# EAGLE design 00_dynaRoACH_MotorDriver_1_Chan (EAGLE 6.5.0)
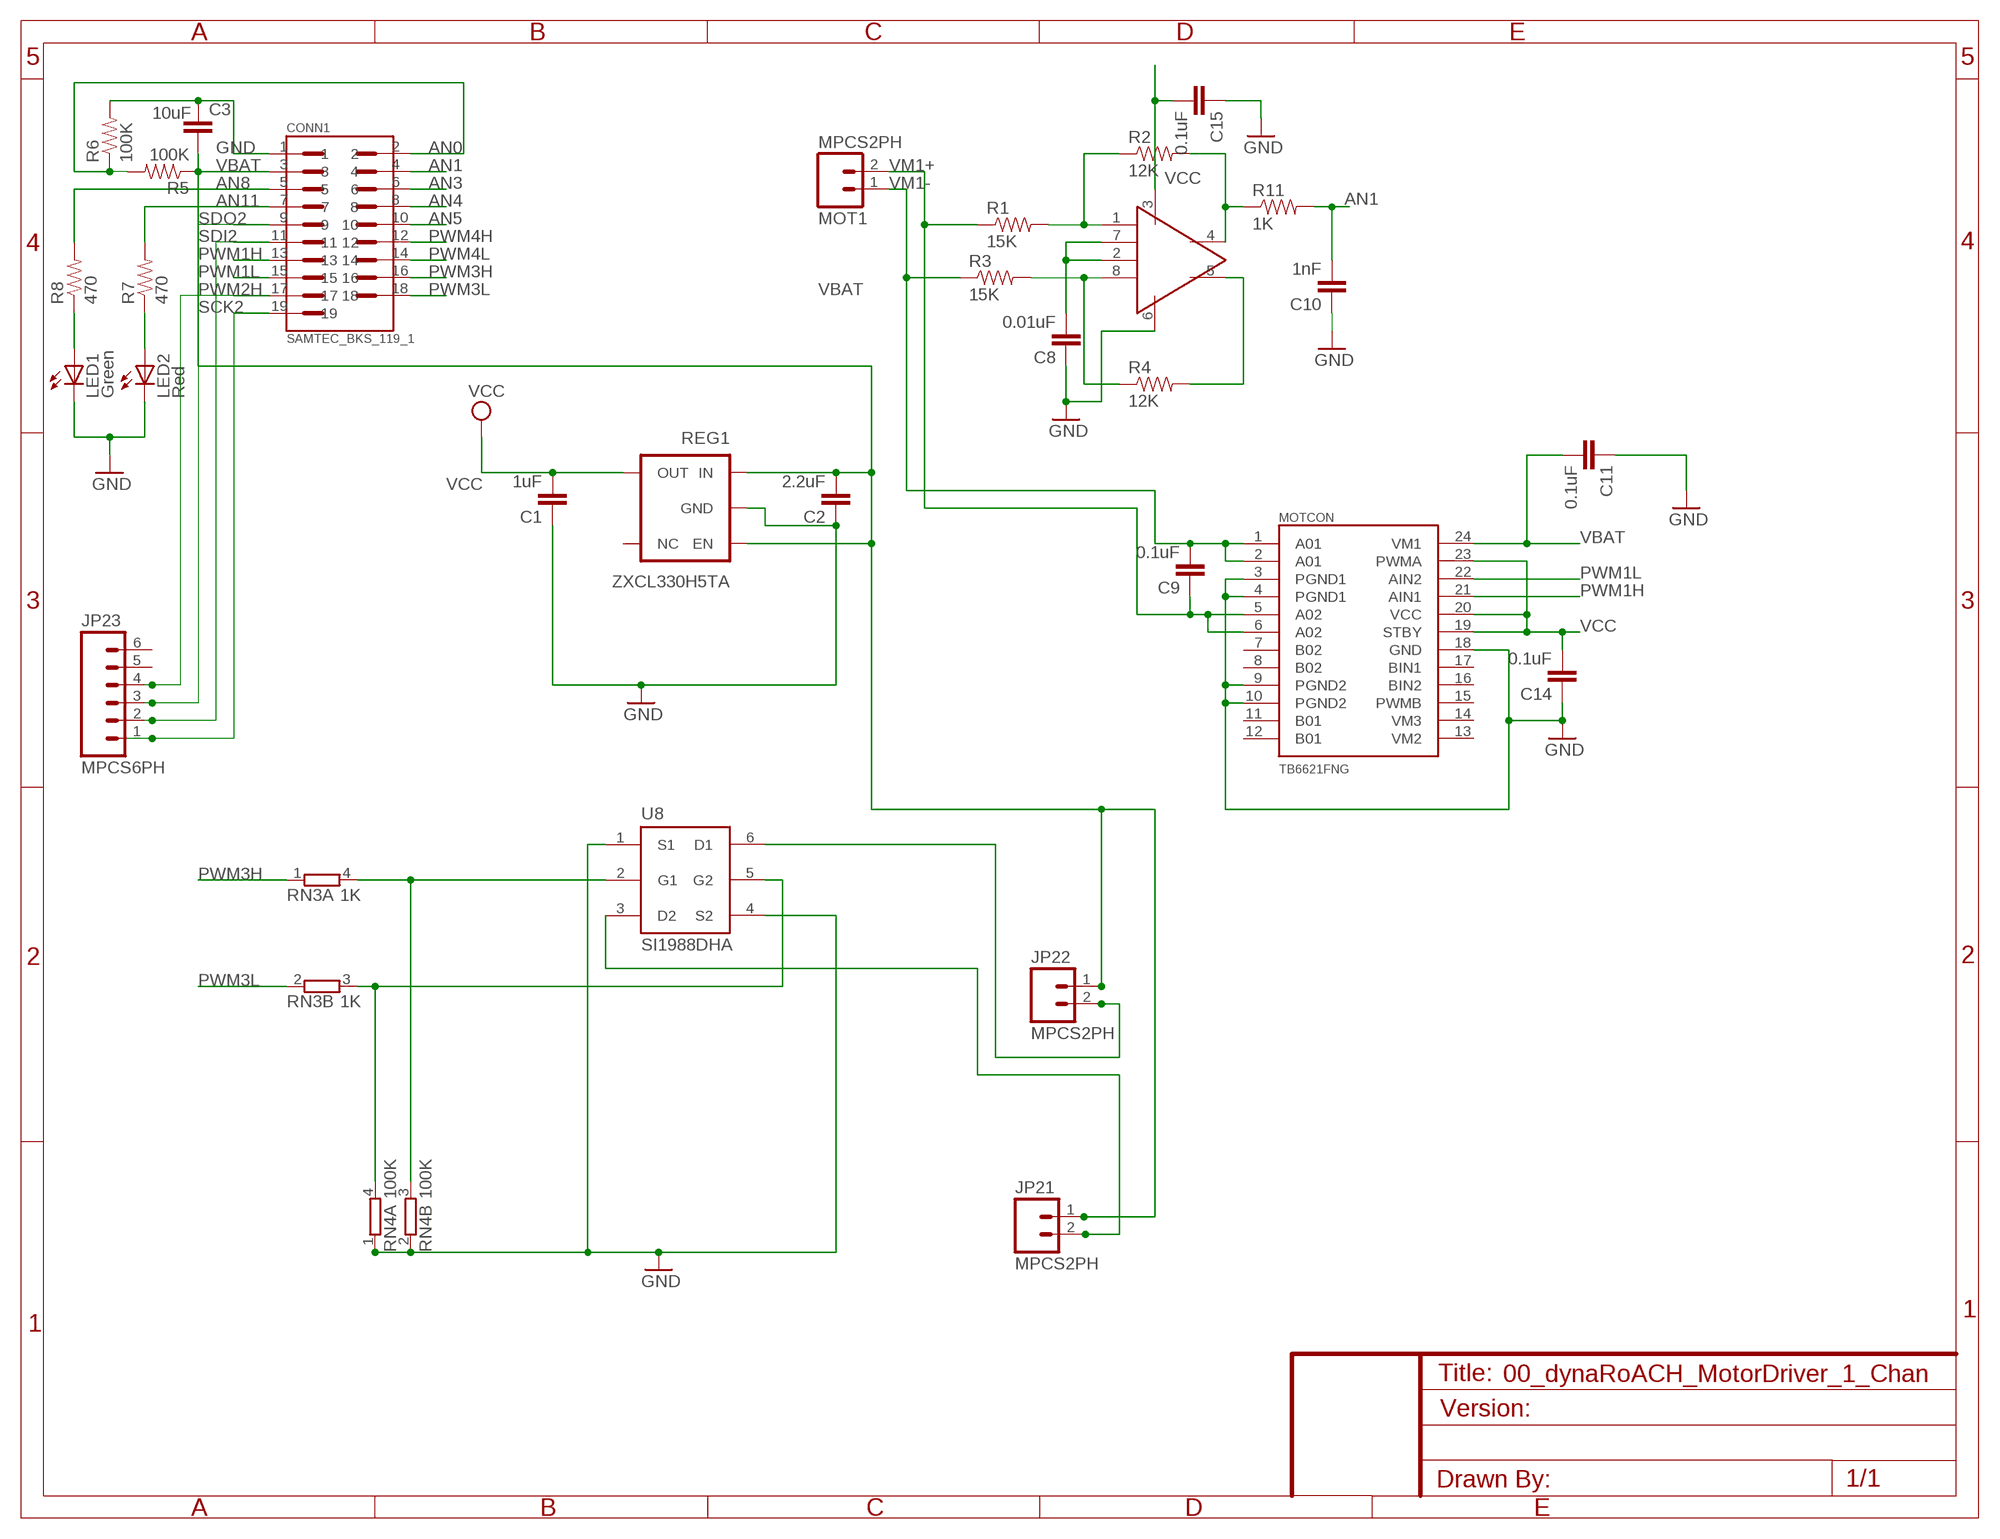
[diagram p0: schematic, sheet 1]

## Parts
C1  1uF  CAP0402-CAP  [0402-CAP]
C2  2.2uF  CAP0402-CAP  [0402-CAP]
C3  10uF  CAP0603-CAP  [0603-CAP]
C8  0.01uF  CAP0402-CAP  [0402-CAP]
C9  0.1uF  CAP0402-CAP  [0402-CAP]
C10  1nF  CAP0402-CAP  [0402-CAP]
C11  0.1uF  CAP0402-CAP  [0402-CAP]
C14  0.1uF  CAP0402-CAP  [0402-CAP]
C15  0.1uF  CAP0402-CAP  [0402-CAP]
CONN1  SAMTEC_BKS_119_1  [SAMTEC_19P_1MM_SOCKET]
JP21  MPCS2PH  [MOLEX-PICO_CLASP_S2P]
JP22  MPCS2PH  [MOLEX-PICO_CLASP_S2P]
JP23  MPCS6PH  [MOLEX-PICO_CLASP_S6P]
LED1  Green  LED0603  [LED-0603]
LED2  Red  LED0603  [LED-0603]
MOT1  MPCS2PH  [MOLEX-PICO_CLASP_S2P]
MOTCON  TB6621FNG  [SSOP24]
R1  15K  RESISTOR0402-RES  [0402-RES]
R2  12K  RESISTOR0402-RES  [0402-RES]
R3  15K  RESISTOR0402-RES  [0402-RES]
R4  12K  RESISTOR0402-RES  [0402-RES]
R5  100K  RESISTOR0402-RES  [0402-RES]
R6  100K  RESISTOR0402-RES  [0402-RES]
R7  470  RESISTOR0402-RES  [0402-RES]
R8  470  RESISTOR0402-RES  [0402-RES]
R11  1K  RESISTOR0402-RES  [0402-RES]
REG1  ZXCL330H5TA  [SC-70-5]
RN3  1K  2R-NEXB24V  [EXB24V]
RN4  100K  2R-NEXB24V  [EXB24V]
U8  SI1988DHA  [SC-70-6]
U$1  LTC1992  [8-PIN_MSOP]

## Nets
AN0 [Signal]: CONN1.2 R5.2 R6.1
AN1 [Signal]: C10.2 CONN1.4 R11.2
AN3 [Signal]: CONN1.6
AN4 [Signal]: CONN1.8
AN5 [Signal]: CONN1.10
AN8 [Signal]: CONN1.5 R8.2
AN11 [Signal]: CONN1.7 R7.2
GND [GND]: C1.1 C2.1 C3.1 C8.1 C10.1 C11.1 C14.1 C15.1 CONN1.1 LED1.C LED2.C MOTCON.3(PGND1) MOTCON.4(PGND1) MOTCON.9(PGND2) MOTCON.10(PGND2) MOTCON.18(GND) R6.2 REG1.2(GND) RN4.1 RN4.2 U8.1(S1) U8.4(S2) U$1.6(GND)
N$1: R1.2 R2.1 U$1.1(-)
N$2: R3.2 R4.1 U$1.8(+)
N$4 [Signal]: RN3.4 RN4.3 U8.2(G1)
N$5: LED1.A R8.1
N$6: LED2.A R7.1
N$7: R4.2 U$1.5(OUT-)
N$12: C8.2 U$1.2(V_OCM) U$1.7(V_MID)
N$18: R2.2 R11.1 U$1.4(OUT+)
N$21 [Signal]: JP22.2 U8.6(D1)
N$22 [Signal]: JP21.2 U8.3(D2)
N$50 [Signal]: RN3.3 RN4.4 U8.5(G2)
PWM1H [Signal]: CONN1.13 MOTCON.21(AIN1)
PWM1L [Signal]: CONN1.15 MOTCON.22(AIN2)
PWM2H [Signal]: CONN1.17 JP23.4
PWM3H [Signal]: CONN1.16 RN3.1
PWM3L [Signal]: CONN1.18 RN3.2
PWM4H [Signal]: CONN1.12
PWM4L [Signal]: CONN1.14
SCK2 [Signal]: CONN1.19 JP23.1
SDI2 [Signal]: CONN1.11 JP23.2
SDO2 [Signal]: CONN1.9 JP23.3
VBAT: C2.2 C3.2 C11.2 CONN1.3 JP21.1 JP22.1 MOTCON.24(VM1) R5.1 REG1.1(IN) REG1.3(EN)
VCC [VCC]: C1.2 C14.2 C15.2 MOTCON.19(STBY) MOTCON.20(VCC) MOTCON.23(PWMA) REG1.5(OUT) U$1.3(VDD)
VM1+: C9.1 MOT1.2 MOTCON.5(A02) MOTCON.6(A02) R1.1
VM1-: C9.2 MOT1.1 MOTCON.1(A01) MOTCON.2(A01) R3.1
Unconnected: JP23.5 JP23.6 MOTCON.7(B02) MOTCON.8(B02) MOTCON.11(B01) MOTCON.12(B01) MOTCON.13(VM2) MOTCON.14(VM3) MOTCON.15(PWMB) MOTCON.16(BIN2) MOTCON.17(BIN1) REG1.4(NC)

## Library data of the parts
C1-C3 C8-C11 C14 C15 = SparkFun:CAP: Capacitor Standard 0603 ceramic capacitor, and 0.1" leaded capacitor.
CONN1 = AMH:SAMTEC_BKS_119_1: Socket connector
JP21 JP22 MOT1 = stan:MPCS2P: Molex Pico-Clasp Single Row 2 POS
JP23 = stan:MPCS6P: Molex Pico-Clasp Single Row 6 Pos
LED1 LED2 = SparkFun:LED: LEDs Standard schematic elements and footprints for 5mm, 3mm, 1206, and 0603 sized LEDs. 5mm - Spark Fun Electronics SKU : COM-00529 (and others)
MOTCON = SparkFun:TB6621FNG: Toshiba 1A motor driver
R1-R8 R11 = SparkFun:RESISTOR: Resistor Basic schematic elements and footprints for 0603, 1206, and PTH 1/10th watt (small) resistors.
REG1 = stan:ZXCL330: Zetex ZXCL Series Voltage Regulator
RN3 RN4 = resistor-dil:2R-N: Array Chip Resistor Source: Panasonic
U8 = stan:SI1988DH: 2 N-Channel MOSFET Package: SC-70-6
U$1 = AMH:LTC1992: Differential amplifier

## Net classes
0 Power: width 0.305 mm, drill 0.254 mm, clearance 0.152 mm
1 Signal: width 0.152 mm, drill 0.254 mm, clearance 0.152 mm
2 GND: width 0.305 mm, drill 0.254 mm, clearance 0.152 mm
3 VCC: width 0.254 mm, drill 0.254 mm, clearance 0.152 mm

## Board
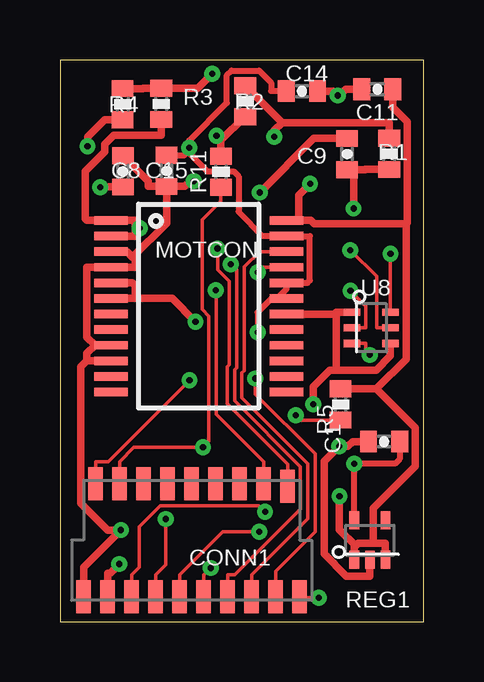
[diagram p1: board, top side]
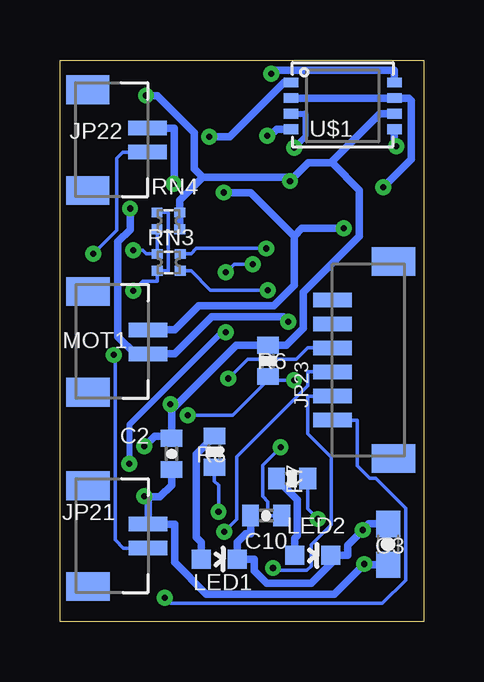
[diagram p2: board, bottom side, seen from below]

Size 15.15 x 23.4 mm. Coordinates in mm from the lower left corner, seen from the top.
Outline: 0,0 15.15,0 15.15,23.4 0,23.4 0,0
Copper layers (1*16): Top 0.035mm / dielectric 1.5mm / Bottom 0.035mm
Design rules "default *": minimum track width 5mil, minimum drill 10mil, track to track 6mil, track to pad 6mil, pad to pad 6mil, via to via 6mil, smd to smd 6mil, copper to edge 0mil, drill to drill 8mil, minimum pad ring 10mil, minimum via ring 8mil, stop-mask expansion 4mil, vias tented up to drill 0mil, thermal gap 10mil

### Footprints (pad centres in the part's own frame; a part is rotated, then mirrored left to right if it is on the bottom)
0402-CAP = smd 0.7 x 0.9: 1 -0.65,0; 2 0.65,0
0603-CAP = smd 1.1 x 1: 1 -0.85,0; 2 0.85,0
SAMTEC_19P_1MM_SOCKET = smd 0.61 x 1.375: 1 -4,-2.362; 2 -3.5,2.362; 3 -3,-2.362; 4 -2.5,2.362; 5 -2,-2.362; 6 -1.5,2.362; 7 -1,-2.362; 8 -0.5,2.362; 9 0,-2.362; 10 0.5,2.362; 11 1,-2.362; 12 1.5,2.362; 13 2,-2.362; 14 2.5,2.362; 15 3,-2.362; 16 3.5,2.362; 17 4,-2.362; 18 4.5,2.25; 19 5,-2.362
MOLEX-PICO_CLASP_S2P = smd 0.6 x 1.6: 1 -0.5,1; 2 0.5,1 | smd 1.2 x 1.8: A -2.1,-1.5; B 2.1,-1.5
MOLEX-PICO_CLASP_S6P = smd 0.6 x 1.6: 1 -2.5,1; 2 -1.5,1; 3 -0.5,1; 4 0.5,1; 5 1.5,1; 6 2.5,1 | smd 1.2 x 1.8: A -4.1,-1.55; B 4.1,-1.55
LED-0603 = smd 0.8 x 0.8: A 0,-0.75; C 0,0.75
SSOP24 = smd 0.348 x 1.397: 1 -3.575,-3.656; 2 -2.925,-3.656; 3 -2.275,-3.656; 4 -1.625,-3.656; 5 -0.975,-3.656; 6 -0.325,-3.656; 7 0.325,-3.656; 8 0.975,-3.656; 9 1.625,-3.656; 10 2.275,-3.656; 11 2.925,-3.656; 12 3.575,-3.656; 13 3.575,3.656; 14 2.925,3.656; 15 2.275,3.656; 16 1.625,3.656; 17 0.975,3.656; 18 0.325,3.656; 19 -0.325,3.656; 20 -0.975,3.656; 21 -1.625,3.656; 22 -2.275,3.656; 23 -2.925,3.656; 24 -3.575,3.656
0402-RES = smd 0.7 x 0.9: 1 -0.65,0; 2 0.65,0
SC-70-5 = smd 0.4 x 0.75: 1 -0.65,-0.825; 2 0,-0.825; 3 0.65,-0.825; 4 0.65,0.825; 5 -0.65,0.825
EXB24V = smd 0.4 x 0.45: 1 -0.35,-0.475; 2 0.35,-0.475; 3 0.35,0.475; 4 -0.35,0.475
SC-70-6 = smd 0.3 x 0.7: 1 -0.65,-0.8; 2 0,-0.8; 3 0.65,-0.8; 4 0.65,0.8; 5 0,0.8; 6 -0.65,0.8
8-PIN_MSOP = smd 0.6 x 0.41: 1 -2.15,0.975; 2 -2.15,0.325; 3 -2.15,-0.325; 4 -2.15,-0.975; 5 2.15,-0.975; 6 2.15,-0.325; 7 2.15,0.325; 8 2.15,0.975

### Placement (x,y rotation side)
C1  13.5,7.5 0 top
C2  10.5,6.99 270 bottom
C3  1.48,3.22 270 bottom
C8  2.62,18.76 270 top
C9  11.96,19.48 90 top
C10  6.56,4.42 0 bottom
C11  13.22,22.18 0 top
C14  10.08,22.1 180 top
C15  4.44,18.78 90 top
CONN1  4.98,3.39 0 top
JP21  12.48,3.56 270 bottom
JP22  12.5,20.06 270 bottom
JP23  2.8,10.9 90 bottom
LED1  8.52,2.6 270 bottom
LED2  4.62,2.76 270 bottom
MOT1  12.48,11.65 270 bottom
MOTCON  5.78,13.14 270 top
R1  13.72,19.49 90 top
R2  7.72,21.68 270 top
R3  4.22,21.57 90 top
R4  2.61,21.56 270 top
R5  11.69,9.05 270 top
R6  6.49,10.86 90 bottom
R7  5.48,5.96 0 bottom
R8  8.72,7.08 270 bottom
R11  6.71,18.74 270 top
REG1  12.91,3.4 0 top
RN3  10.62,14.97 90 bottom
RN4  10.63,16.7 90 bottom
U8  12.97,12.24 270 top
U$1  3.37,21.49 0 bottom

### Tracks (layer width: path | path; a pad name or v marks a point on that pad's centre or on a via)
AN0  (via drill 0.25 pad 0.66)
  Top 0.152: CONN1.2 1.48,6.67 2.01,6.67 v5.4,10.06 | v9.82,8.59 10.01,8.4 11.01,8.4 R5.2
  Bottom 0.152: 6.49,10.06 7.96,8.59 v9.82,8.59 | 6.49,10.06 R6.1 | 6.49,10.06 v5.4,10.06
AN1  (via drill 0.25 pad 0.66)
  Top 0.152: CONN1.4 2.48,6.67 3.08,7.26 v5.96,7.26 6.2,7.51 6.2,12.73 5.93,13 5.93,16.73 6.71,17.52 R11.2
  Bottom 0.152: C10.2 6.49,4.42 6.49,5 6.71,5.22 6.71,6.51 v5.96,7.26
AN8  (via drill 0.25 pad 0.66)
  Top 0.152: v8.55,4.57 8.28,4.84 4.18,4.84 3.3,3.96 3.3,2.26 2.98,1.95 CONN1.5
  Bottom 0.152: R8.2 8.72,5.85 8.55,5.68 v8.55,4.57
AN11  (via drill 0.25 pad 0.66)
  Top 0.152: CONN1.7 3.98,1.95 4.41,2.37 v4.41,4.28
  Bottom 0.152: R7.2 4.83,4.69 v4.41,4.28
GND  (via drill 0.25 pad 0.66)
  Top 0.305: 11.52,10.48 13.17,10.48 13.77,11.07 U8.4 | C15.1 3.68,18.13 3.68,18.34 C8.1 | 3.02,15.19 4.44,16.61 C15.1 | 1.46,11.52 1.12,11.17 1.12,10.87 | 1.46,11.52 1.68,11.52 MOTCON.9 | 1.46,11.52 1.12,11.86 1.12,14.77 MOTCON.4 2.63,14.77 3.13,14.77 3.13,15.08 3.02,15.19 | 1.12,10.87 0.87,10.62 0.87,4.93 1.99,3.81 v2.54,3.81 0.98,2.26 0.98,2.02 CONN1.1 | 3.02,15.19 2.79,15.41 2.57,15.41 MOTCON.3 | MOTCON.10 1.12,10.87 | 11.57,22.01 11.75,22.01 11.91,22.18 C11.1 | 11.57,22.01 11.48,22.01 11.39,22.1 C14.1 | 11.57,22.01 v11.57,21.92 | C15.1 5.2,18.13 5.42,18.36 v5.57,18.36 | REG1.2 12.91,1.9 11.93,1.9 11.01,2.82 11.01,6.68 v11.63,7.3 12,7.3 12.2,7.5 C1.1 | 11.52,12.81 11.52,12.89 U8.1 | 11.52,10.48 11.52,12.81 | 11.52,12.81 10.44,12.81 MOTCON.18 | v10.55,9.05 10.55,9.79 11.24,10.48 11.52,10.48
  Bottom 0.305: 9.2,18.51 5.73,18.51 v5.57,18.36 4.81,19.11 3.82,19.11 | 9.2,18.51 10.16,17.55 RN4.2 RN4.1 | 9.2,18.51 9.56,18.88 9.56,20.37 11.11,21.92 v11.57,21.92 | 3.82,19.11 2.68,17.97 2.68,16.05 5.01,13.72 5.01,12.23 5.73,11.51 R6.2 7.25,11.51 7.8,11.51 10.41,8.91 | 3.52,2.76 4.68,1.6 6.54,1.6 7.07,2.13 7.07,2.6 LED1.C 7.77,3.31 7.41,3.67 7.21,3.67 C10.1 | 3.52,2.76 3.16,2.76 3.16,3.19 v2.54,3.81 2.29,4.07 C3.1 | LED2.C 3.52,2.76 | 3.82,19.11 3.82,19.18 1.82,21.16 U$1.6 | 10.5,7.72 11.21,7.72 v11.63,7.3 | 10.5,7.72 10.5,8.29 10.5,8.81 10.41,8.91 | C2.1 10.5,7.72 | v10.55,9.05 10.41,8.91
N$1  (via drill 0.25 pad 0.66)
  Top 0.305: 9.25,20.8 13.72,20.8 R1.2 | R2.1 9.25,20.8 | v8.92,20.2 8.92,20.46 9.25,20.8
  Bottom 0.305: U$1.1 5.81,22.46 8.07,20.2 v8.92,20.2
N$2  (via drill 0.25 pad 0.66)
  Top 0.305: v6.35,22.82 5.75,22.22 4.98,22.22 R3.2 3.96,22.22 3.46,22.22 3.45,22.21 R4.1
  Bottom 0.305: v6.35,22.82 6.19,22.98 1.22,22.98 U$1.8
N$4  (via drill 0.25 pad 0.66)
  Top 0.152: v12.1,13.78 12.75,13.14 12.75,12.24 U8.2
  Bottom 0.152: v12.1,13.78 11.69,14.19 11.09,14.19 RN3.4 10.64,14.62 10.64,17.04 10.65,17.05 RN4.3
N$5
  Bottom 0.305: LED1.A 9.27,3.31 9.48,3.51 9.48,6.97 R8.1
N$6
  Bottom 0.305: LED2.A 5.37,3.46 5.25,3.58 5.25,5.08 R7.1
N$7  (via drill 0.25 pad 0.66)
  Top 0.305: v1.15,19.81 1.15,20.2 1.86,20.91 R4.2
  Bottom 0.305: U$1.5 1.22,20 1.15,19.93 v1.15,19.81
N$12  (via drill 0.25 pad 0.66)
  Top 0.305: v1.68,18.09 1.85,18.09 1.86,18.11 C8.2
  Bottom 0.305: v1.68,18.09 0.51,19.26 0.51,21.71 0.61,21.82 U$1.7 U$1.2
N$18  (via drill 0.25 pad 0.66)
  Top 0.305: 6.71,20.05 v6.52,20.24 | v6.52,20.24 | 6.71,20.05 7.69,21.03 R2.2 | R11.1 6.71,20.05
  Bottom 0.305: v6.52,20.24 6.4,20.24 6.12,20.52 U$1.4
N$21  (via drill 0.25 pad 0.66)
  Top 0.152: U8.6 v13.77,15.33
  Bottom 0.152: v13.77,15.33 12.79,16.31 12.79,19.3 12.53,19.56 JP22.2
N$22  (via drill 0.25 pad 0.66)
  Top 0.152: v12.91,11.11 12.75,11.27 12.75,11.59 U8.3
  Bottom 0.152: v12.91,11.11 12.85,11.05 12.85,3.4 12.51,3.06 JP21.2
N$50  (via drill 0.25 pad 0.66)
  Top 0.152: U8.5 13.19,12.24 13.19,14.38 v12.1,15.47
  Bottom 0.152: v12.1,15.47 11.7,15.47 11.55,15.32 RN3.3 11.09,15.75 11.09,15.91 11.11,15.92 RN4.4
PWM1H  (via drill 0.25 pad 0.66)
  Top 0.152: v7.12,14.89 7.36,14.66 7.36,10.57 7.27,10.49 7.27,9.2 10.02,6.46 10.02,4.67 7.29,1.95 6.98,1.95 CONN1.13 | v8.24,14.55 8.45,14.77 8.51,14.77 MOTCON.21
  Bottom 0.152: v7.12,14.89 7.9,14.89 v8.24,14.55
PWM1L
  Top 0.152: CONN1.15 7.98,1.95 10.32,4.29 10.32,6.59 7.58,9.33 7.58,10.36 7.67,10.45 7.67,14.58 7.68,14.59 7.68,14.78 8.31,15.41 8.51,15.41 MOTCON.22
PWM2H  (via drill 0.25 pad 0.66)
  Top 0.152: v8.14,10.13 8.14,9.48 10.63,6.99 10.63,3.75 8.98,2.1 CONN1.17
  Bottom 0.152: JP23.4 4.83,11.4 5.3,10.93 7.34,10.93 v8.14,10.13
PWM3H  (via drill 0.25 pad 0.66)
  Top 0.152: v6.49,13.81 6.51,13.79 6.51,8.64 8.48,6.67 CONN1.16
  Bottom 0.152: v6.49,13.81 8.88,13.81 9.69,14.62 RN3.1
PWM3L  (via drill 0.25 pad 0.66)
  Top 0.152: v6.56,15.55 6.56,14.66 7.05,14.17 7.05,10.69 6.97,10.61 6.97,9.07 9.48,6.56 CONN1.18
  Bottom 0.152: v6.56,15.55 9.46,15.55 9.69,15.32 RN3.2
SCK2  (via drill 0.25 pad 0.66)
  Top 0.152: v10.79,1 10.01,1 CONN1.19
  Bottom 0.152: JP23.1 2.77,8.4 2.77,6.5 2.25,5.97 2,5.97 0.75,4.72 0.75,1.72 1.72,0.76 10.54,0.76 v10.79,1
SDI2  (via drill 0.25 pad 0.66)
  Top 0.152: v6.27,2.23 5.98,1.95 CONN1.11
  Bottom 0.152: v6.27,2.23 6.17,2.13 4.87,2.13 4.68,2.32 4.68,3.21 3.85,4.04 3.85,6.86 4.83,7.83 4.83,9.4 JP23.2
SDO2  (via drill 0.25 pad 0.66)
  Top 0.152: v8.3,3.75 | v8.3,3.75 6.79,3.75 4.98,1.95 CONN1.9
  Bottom 0.152: v8.3,3.75 7.79,4.26 7.79,6.87 4.83,9.83 4.83,10.4 JP23.3
VBAT  (via drill 0.25 pad 0.66)
  Top 0.305: 12.32,3.15 12.26,3.09 12.26,2.92 REG1.1 | 13.05,3.25 12.42,3.25 12.32,3.15 | 12.32,3.15 11.65,3.83 v11.65,5.22 | 9.94,16.71 9.94,17.75 v10.42,18.24 | 9.94,16.71 10.44,16.71 10.59,16.57 14.43,16.57 | MOTCON.24 9.94,16.71 | 14.43,16.57 14.43,10.94 13.19,9.7 | 14.43,16.57 14.48,16.62 14.48,20.82 13.87,21.43 C11.2 | 13.05,3.25 13.56,3.25 REG1.3 | 13.05,3.25 13.05,4.73 14.8,6.48 14.8,8.08 13.19,9.7 | 13.19,9.7 R5.1 | v2.47,2.4 2.1,2.02 1.98,2.02 CONN1.3
  Bottom 0.305: 11.48,5.2 JP21.1 10.38,4.06 10.38,2.47 9.05,1.14 3.73,1.14 v2.47,2.4 2.45,2.37 C3.2 | 11.48,5.2 10.98,5.2 10.5,5.68 C2.2 | v11.65,5.22 11.5,5.22 11.48,5.2 | JP22.1 10.39,20.56 10.39,18.26 v10.42,18.24
VCC  (via drill 0.25 pad 0.66)
  Top 0.254: REG1.5 12.26,4.88 v12.26,6.58 13.96,6.58 14.15,6.77 C1.2 | 5.37,19.54 6.14,18.76 7.24,18.76 7.44,18.56 7.44,17.08 8.46,16.07 MOTCON.23 9.93,16.07 10.41,16.07 10.41,14.22 10.31,14.12 MOTCON.20 9.44,13.85 9.05,13.46 | 5.37,19.54 5.37,19.73 v5.38,19.75 5.38,20.04 6.96,21.61 6.96,22.77 7.15,22.96 8.3,22.96 8.8,22.45 8.8,22.1 C14.2 | 5.37,19.54 5.28,19.54 5.17,19.43 C15.2 | 9.05,13.46 8.82,13.46 8.24,12.89 v8.24,12.06 | MOTCON.19 9.05,13.46
  Bottom 0.254: U$1.3 4.94,21.16 4.94,20.19 v5.38,19.75 | v8.24,12.06 8.4,12.06 12.26,8.2 v12.26,6.58
VM1+  (via drill 0.25 pad 0.66)
  Top 0.305: 12.34,18.83 12.23,18.72 v12.23,17.21 | 12.34,18.83 12.72,18.83 12.73,18.84 R1.1 | C9.1 12.34,18.83 | v5.64,12.5 4.68,13.46 3.13,13.46 | 3.13,13.46 3.13,14 3.01,14.12 MOTCON.5 | MOTCON.6 3.13,13.46
  Bottom 0.305: v12.23,17.21 12.23,16.33 12.74,15.82 12.74,11.88 12.01,11.15 MOT1.2 10.38,11.15 8.83,12.7 5.84,12.7 v5.64,12.5
VM1-  (via drill 0.25 pad 0.66)
  Top 0.305: 3.13,16.39 v3.32,16.39 | 3.13,16.39 3.13,16.71 MOTCON.1 1.12,16.71 1.04,16.79 1.04,18.75 1.86,19.58 1.86,19.89 2.23,20.25 4.21,20.25 4.22,20.27 R3.1 | 3.13,16.39 3.13,16.07 MOTCON.2 | v8.33,17.88 10.58,20.13 C9.2
  Bottom 0.305: 5.39,16.07 5.07,16.39 v3.32,16.39 | 5.39,16.07 7.21,17.88 v8.33,17.88 | 5.39,16.07 5.39,14.01 6.24,13.16 9.36,13.16 10.38,12.15 MOT1.1